# Altium schematic sheet exhaust_gas_temp_oxy.SchDoc
size A4; SheetNumber: 8; SheetTotal: 8
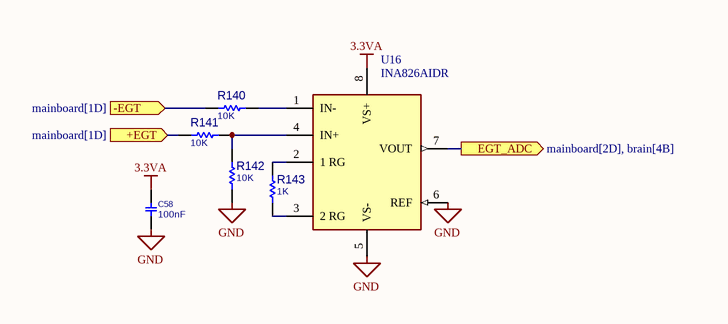
[diagram p0: exhaust_gas_temp_oxy.SchDoc]

## Parts
C58  100nF  [C0805]
R140  10K  [R1206]
R141  10K  [R1206]
R142  10K  [R1206]
R143  1K  [R1206]
U16  INA826AIDR  [SOIC-8]

## Ports
+EGT (in, see mainboard[1D]), -EGT (in, see mainboard[1D]), EGT_ADC (out, see mainboard[2D], brain[4B])

## Nets
3.3VA: C58.2 U16.8(VS+)
GND: C58.1 R142.1 U16.5(VS-) U16.6(REF)
+EGT: R141.1 ; port +EGT
-EGT: R140.2 ; port -EGT
EGT_ADC: U16.7(VOUT) ; port EGT_ADC
NetR140_1: R140.1 U16.1(IN-)
NetR141_2: R141.2 R142.2 U16.4(IN+)
NetR143_1: R143.1 U16.3(2_RG)
NetR143_2: R143.2 U16.2(1_RG)

## Library data of the parts
C58 = CAP_SMD_MLCC_0805: CAP, MLCC; PARAM: -, -%; MANF_P#: MANF_PART#; PARAM2: -V; PRICE: 100= 1$; MANF: -; ASSEMBLY: ASSEMBLY; VALUE: 100nF
R140-R143 = RES_SMD_1206: RESISTOR, SMD; PARAM: 1%, 0.25W; DESC: DESCRIPTION; DIST#: MOUSER; MANF_P#: -; MANF: -; ASSEMBLY: ASSEMBLY; PRICE: -; PARAM2: -
  R140-R142: VALUE: 10K
  R143: VALUE: 1K
U16 = INA826: IC INST AMP 1 CIRCUIT 8SOIC; Number of Circuits: 1; Common Mode Rejection Ratio: 84dB; Power Supply Rejection Ratio (PSRR): 100dB; Input Voltage Noise Density: 18nV/sqrt Hz; Input Resistance: 100kR; Output Current per Channel: 16mA; Input Offset Voltage (Vos): 150uV; Bandwidth: 1MHz; Supply Current: 200uA; Input Bias Current: 65nA; Max Dual Supply Voltage: 18V; Max Supply Voltage: 36V; Min Supply Voltage: 2.7V; Voltage Gain: 60dB; Slew Rate: 1V/µs; Min Dual Supply Voltage: 1.35V; Number of Elements: 1; Series: -; Number of Pins: 8; Lead Free: Lead Free; Output Current: 16mA; REACH SVHC: No SVHC; Min Operating Temperature: -40°C; Quiescent Current: 200uA; Nominal Supply Current: 200uA; Max Operating Temperature: 125°C; RoHS Compliant: Yes; Case/Package: D; -3db Bandwidth: 1MHz; Radiation Hardening: No; Operating Supply Current: 200uA; Packaging: Tape and Reel; Package Quantity: 1; Number of Amplifiers: 1; Number of Channels: 1